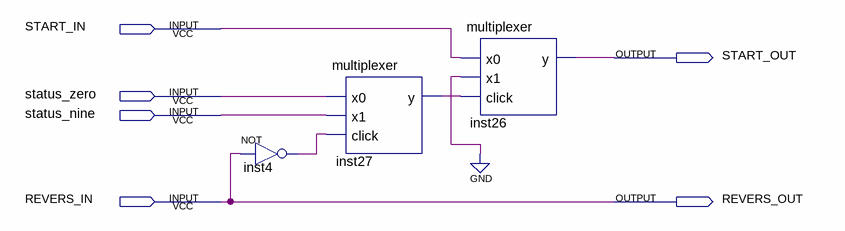
[diagram p0: schematic sheet]
// Quartus schematic blocker.bdf as structural Verilog: 3 symbols, 6 pins
module blocker (
  input  START_IN,
  input  status_zero,
  input  status_nine,
  input  REVERS_IN,
  output START_OUT,
  output REVERS_OUT
);

  wire inst4_out, inst27_y;

  not inst4 (inst4_out, REVERS_IN);
  multiplexer inst27 (.x0(status_zero), .x1(status_nine), .click(inst4_out), .y(inst27_y));
  multiplexer inst26 (.x0(START_IN), .x1(1'b0), .click(inst27_y), .y(START_OUT));

  assign REVERS_OUT = REVERS_IN;
endmodule
